# Altium schematic sheet BSPDSchematic.SchDoc
size OrCAD D
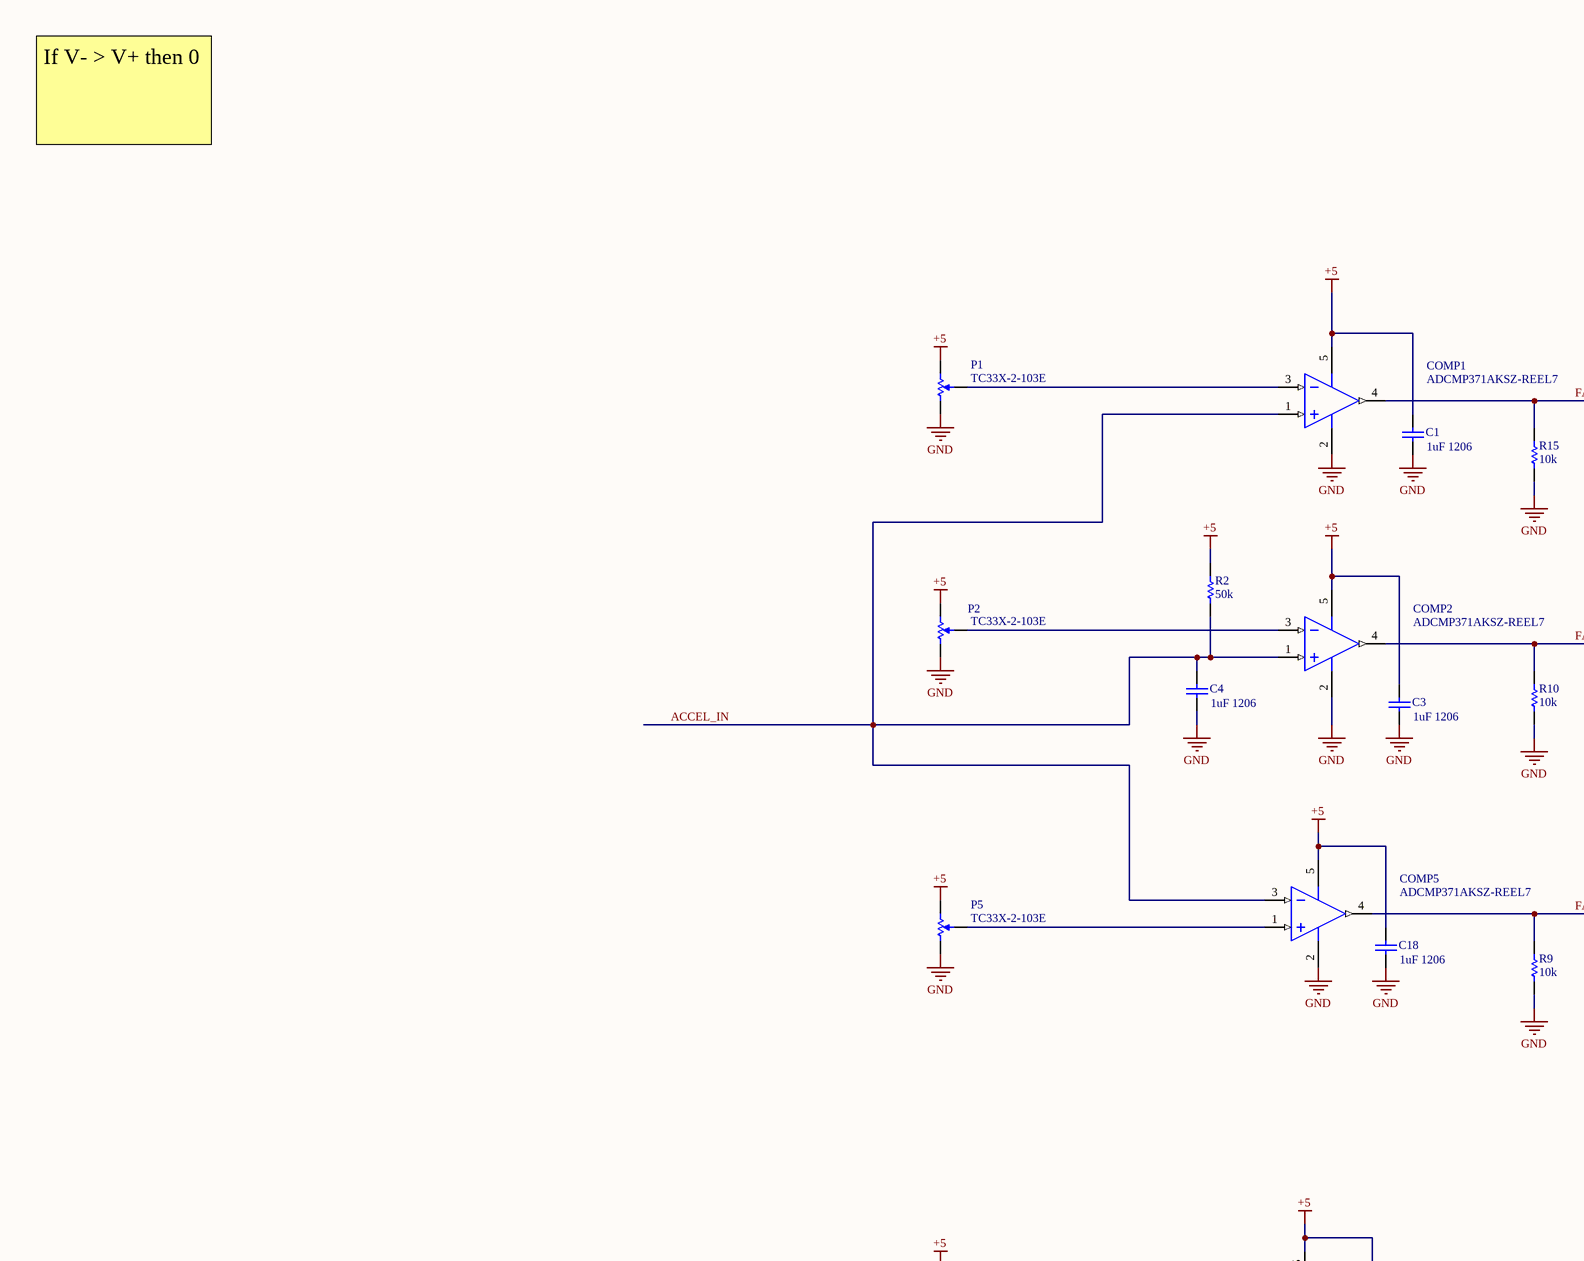
[diagram p0: BSPDSchematic.SchDoc, top left]
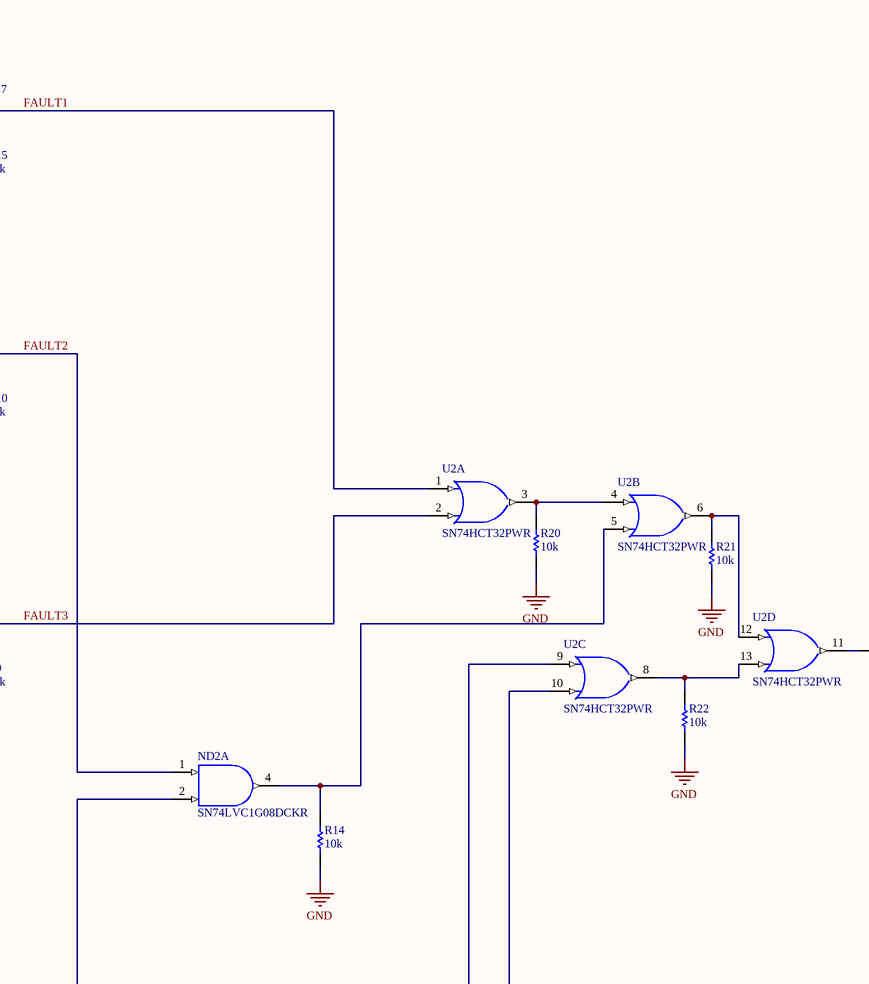
[diagram p1: BSPDSchematic.SchDoc, top middle]
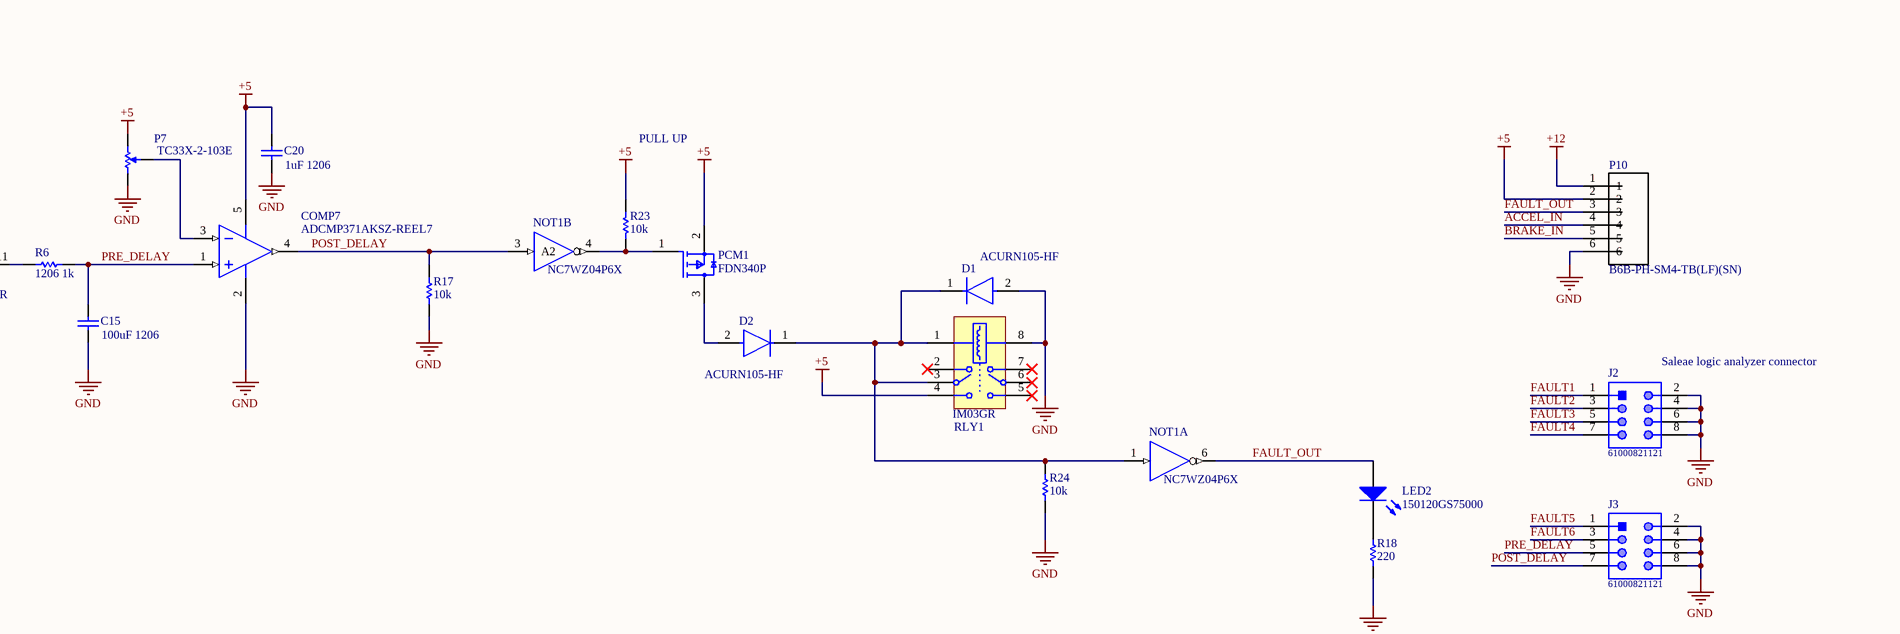
[diagram p2: BSPDSchematic.SchDoc, top right]
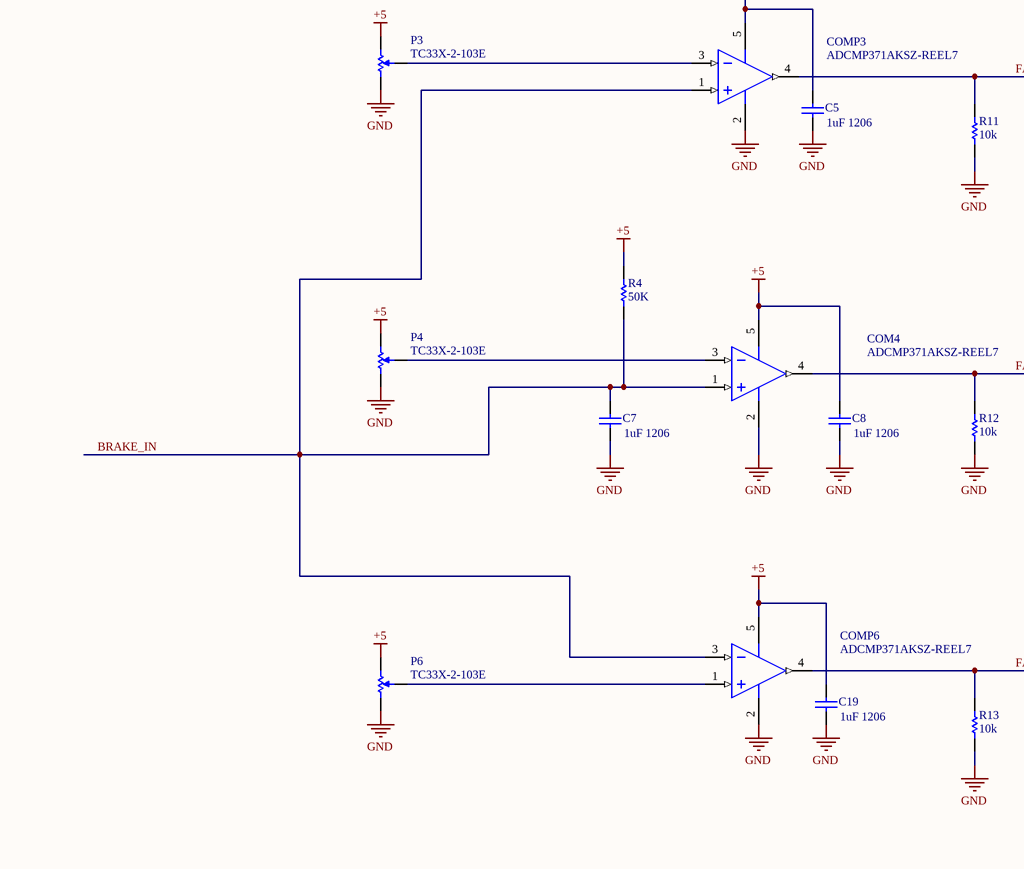
[diagram p3: BSPDSchematic.SchDoc, bottom left]
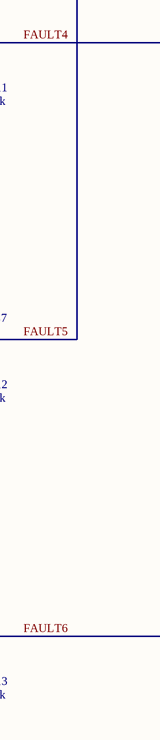
[diagram p4: BSPDSchematic.SchDoc, bottom middle]
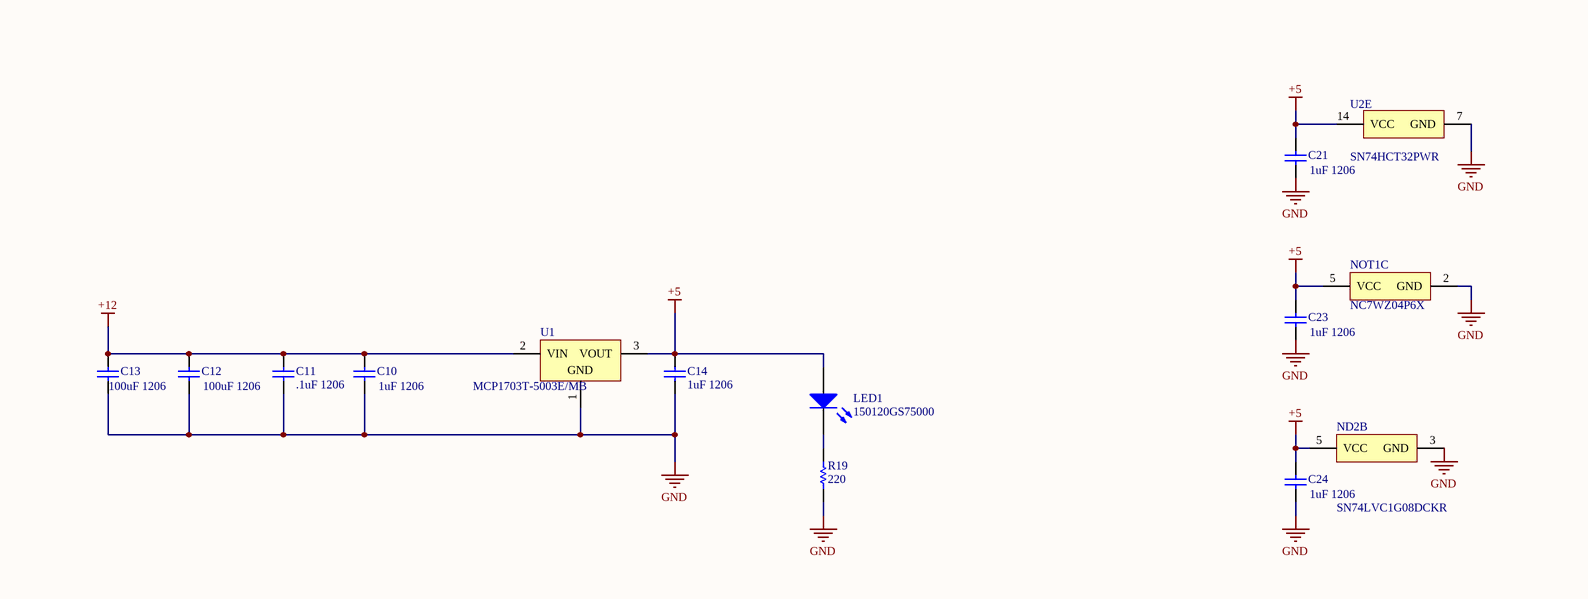
[diagram p5: BSPDSchematic.SchDoc, bottom right]

## Parts
C1  1uF 1206  [CAPC3216X152X50LL20T25]
C3  1uF 1206  [CAPC3216X152X50LL20T25]
C4  1uF 1206  [CAPC3216X152X50LL20T25]
C5  1uF 1206  [CAPC3216X152X50LL20T25]
C7  1uF 1206  [CAPC3216X152X50LL20T25]
C8  1uF 1206  [CAPC3216X152X50LL20T25]
C10  1uF 1206  [CAPC3216X152X50LL20T25]
C11  .1uF 1206  [CAPC1206(3216)190_L]
C12  100uF 1206  [CAPC1206(3216)190_L]
C13  100uF 1206  [CAPC3216X180X50LL20T25]
C14  1uF 1206  [CAPC3216X180X50ML20T25]
C15  100uF 1206  [CAPC3216X152X50LL20T25]
C18  1uF 1206  [CAPC3216X152X50LL20T25]
C19  1uF 1206  [CAPC3216X152X50LL20T25]
C20  1uF 1206  [CAPC3216X152X50LL20T25]
C21  1uF 1206  [CAPC3216X152X50LL20T25]
C23  1uF 1206  [CAPC3216X152X50LL20T25]
C24  1uF 1206  [CAPC3216X152X50LL20T25]
COM4  ADCMP371AKSZ-REEL7  [ADI-KS-5_L]
COMP1  ADCMP371AKSZ-REEL7  [ADI-KS-5_L]
COMP2  ADCMP371AKSZ-REEL7  [ADI-KS-5_L]
COMP3  ADCMP371AKSZ-REEL7  [ADI-KS-5_L]
COMP5  ADCMP371AKSZ-REEL7  [ADI-KS-5_L]
COMP6  ADCMP371AKSZ-REEL7  [ADI-KS-5_L]
COMP7  ADCMP371AKSZ-REEL7  [ADI-KS-5_L]
D1  ACURN105-HF  [FP-1206-MFG]
D2  ACURN105-HF  [FP-1206-MFG]
J2  61000821121  [61000821121]
J3  61000821121  [61000821121]
LED1  150120GS75000  [1206_A]
LED2  150120GS75000  [1206_A]
ND2  SN74LVC1G08DCKR  [DCK0005A_M]  (parts A,B of 2)
NOT1  NC7WZ04P6X  [FAIR-SC70-6_V]  (parts A,B,C of 3)
P1  TC33X-2-103E  [BOUR-TC33X-2_V]
P2  TC33X-2-103E  [BOUR-TC33X-2_V]
P3  TC33X-2-103E  [BOUR-TC33X-2_V]
P4  TC33X-2-103E  [BOUR-TC33X-2_V]
P5  TC33X-2-103E  [BOUR-TC33X-2_V]
P6  TC33X-2-103E  [BOUR-TC33X-2_V]
P7  TC33X-2-103E  [BOUR-TC33X-2_V]
P10  B6B-PH-SM4-TB(LF)(SN)  [*JST_B6B-PH-SM4-TB(LF)(SN)]
PCM1  FDN340P  [FP-527AG-MFG]
R2  50k  [RESC3216X60X45ML10T20]
R4  50K  [RESC3216X60X45ML10T20]
R6  1206 1k  [RESC3216X60X45ML10T20]
R9  10k  [RESC3216X60X45ML10T20]
R10  10k  [RESC3216X60X45ML10T20]
R11  10k  [RESC3216X60X45ML10T20]
R12  10k  [RESC3216X60X45ML10T20]
R13  10k  [RESC3216X60X45ML10T20]
R14  10k  [RESC3216X60X45ML10T20]
R15  10k  [RESC3216X60X45ML10T20]
R17  10k  [RESC3216X60X45ML10T20]
R18  220  [RESC3216X60X45ML10T20]
R19  220  [RESC3216X60X45ML10T20]
R20  10k  [RESC3216X60X45ML10T20]
R21  10k  [RESC3216X60X45ML10T20]
R22  10k  [RESC3216X60X45ML10T20]
R23  10k  [RESC3216X60X45ML10T20]
R24  10k  [RESC3216X60X45ML10T20]
RLY1  IM03GR  [TECO-IM-8G-WING]
U1  MCP1703T-5003E/MB  [SOT-89_L]
U2  SN74HCT32PWR  [PW0014A_N]  (parts A,B,C,D,E of 5)

## Nets
+5: C1.2 C3.2 C5.2 C8.2 C14.2 C18.2 C19.2 C20.2 C21.2 C23.2 C24.2 COM4.5(VCC) COMP1.5(VCC) COMP2.5(VCC) COMP3.5(VCC) COMP5.5(VCC) COMP6.5(VCC) COMP7.5(VCC) LED1.2(A) ND2.5(VCC) NOT1.5(VCC) P1.3 P2.3 P3.3 P4.3 P5.3 P6.3 P7.3 P10.2 PCM1.2(S) R2.1 R4.1 R23.2 RLY1.4 U1.3(VOUT) U2.14(VCC)
+12: C10.2 C11.2 C12.2 C13.2 P10.1 U1.2(VIN)
GND: C1.1 C3.1 C4.1 C5.1 C7.1 C8.1 C10.1 C11.1 C12.1 C13.1 C14.1 C15.1 C18.1 C19.1 C20.1 C21.1 C23.1 C24.1 COM4.2(GND) COMP1.2(GND) COMP2.2(GND) COMP3.2(GND) COMP5.2(GND) COMP6.2(GND) COMP7.2(GND) D1.2(A) J2.2 J2.4 J2.6 J2.8 J3.2 J3.4 J3.6 J3.8 ND2.3(GND) NOT1.2(GND) P1.1 P2.1 P3.1 P4.1 P5.1 P6.1 P7.1 P10.6 R9.2 R10.2 R11.2 R12.2 R13.2 R14.2 R15.2 R17.2 R18.2 R19.2 R20.2 R21.2 R22.2 R24.2 RLY1.8 U1.1(GND) U2.7(GND)
ACCEL_IN: C4.2 COMP1.1(IN+) COMP2.1(IN+) COMP5.3(IN-) P10.4 R2.2
BRAKE_IN: C7.2 COM4.1(IN+) COMP3.1(IN+) COMP6.3(IN-) P10.5 R4.2
FAULT1: COMP1.4(OUT) J2.1 R15.1 U2.1(1A)
FAULT2: COMP2.4(OUT) J2.3 ND2.1(A) R10.1
FAULT3: COMP5.4(OUT) J2.5 R9.1 U2.2(1B)
FAULT4: COMP3.4(OUT) J2.7 R11.1 U2.9(3A)
FAULT5: COM4.4(OUT) J3.1 ND2.2(B) R12.1
FAULT6: COMP6.4(OUT) J3.3 R13.1 U2.10(3B)
FAULT_OUT: LED2.2(A) NOT1.6(Y1) P10.3
POST_DELAY: COMP7.4(OUT) J3.7 NOT1.3(A2) R17.1
PRE_DELAY: C15.2 COMP7.1(IN+) J3.5 R6.2
NetCOM4_3: COM4.3(IN-) P4.2
NetCOMP1_3: COMP1.3(IN-) P1.2
NetCOMP2_3: COMP2.3(IN-) P2.2
NetCOMP3_3: COMP3.3(IN-) P3.2
NetCOMP5_1: COMP5.1(IN+) P5.2
NetCOMP6_1: COMP6.1(IN+) P6.2
NetCOMP7_3: COMP7.3(IN-) P7.2
NetD1_1: D1.1(C) D2.1(C) NOT1.1(A1) R24.1 RLY1.1 RLY1.3
NetD2_2: D2.2(A) PCM1.3(D)
NetLED1_1: LED1.1(K) R19.1
NetLED2_1: LED2.1(K) R18.1
NetND2_4: ND2.4(Y) R14.1 U2.5(2B)
NetNOT1_4: NOT1.4(Y2) PCM1.1(G) R23.1
NetR6_1: R6.1 U2.11(4Y)
NetR20_1: R20.1 U2.3(1Y) U2.4(2A)
NetR21_1: R21.1 U2.6(2Y) U2.12(4A)
NetR22_1: R22.1 U2.8(3Y) U2.13(4B)

Not connected (* = marked no-connect by the designer): RLY1 2* 5* 6* 7*

## Notes on the sheet
- If V- > V+ then 0
- PULL UP
- (near J2) Saleae logic analyzer connector

## Library data of the parts
C1 C3-C5 C7 C8 C10 C15 C18-C21 C23 C24 = CMP-2000-05868-1: Chip Capacitor, 330 nF, +/- 10%, 50 V, -55 to 125 degC, 1206 (3216 Metric), RoHS, Tape and Reel; Manufacturer: AVX; Dielectric: X7R; Capacitance: 330nF; Rated Voltage: 50V; Package Reference: 1206; Tolerance (%): ±10%; Datasheet Version: 07/2016; Manufacturer URL: http://www.avx.com/; Case Size/Dimension: 1206; Datasheet URL: http://datasheets.avx.com/X7RDielectric.pdf; Package Description: 2-Pin Surface Mount Device, Body 3.2 x 1.6 mm; Mounting Technology: SurfaceMount
C11 C12 = CMP-1037-05005-1: CAP 100uF 6.3V ±20% 1206 (3216 Metric) Thickness 1.9mm SMD; Tolerance: Â±20%; Case-EIA: 1206; Case-Metric: 3216; Technology: SMT; Max Thickness: 1.9 mm; Rated Voltage: 6.3 V; Value: 100uF
C13 = CMP-2000-06014-1: Chip Capacitor, 2.2 uF, +/- 10%, 16 V, -55 to 125 degC, 1206 (3216 Metric), RoHS, Tape and Reel; Manufacturer: Kemet; Capacitance - nF: 2200nF; Voltage Rating DC: 16V; Class: Class1; Temperature Coefficient / Code: +/-15%; Case Height: 1mm; Dissipation Factor DF: 5; Capacitance: 2.2uF; Type: SMDMLCCX7R6.3-250VDCCommericalGrade; Case Width: 1.6mm; Dielectric: X7R; Case Length: 3.2mm; Series: C1206C; Tolerance: 10%; Datasheet URL: http://www.kemet.com/docfinder?Partnumber=C1206C106K8RACTU; Package Description: 2-Pin Surface Mount Device, Body 3.2 x 1.6 mm; RoHS: Details; Datasheet Version: 02/2016; Package / Case: 1206(3216metric); Case Code - mm: 3216; Packaging: Reel; Product Category: MultilayerCeramicCapacitorsMLCC-SMD/SMT; Package Reference: 1206; Maximum Operating Temperature: +125C; Mounting Technology: SurfaceMount; Dimensions: 1.6mmWx3.2mmLx1mmH; Case Code - in: 1206; Minimum Operating Temperature: -55C; Operating Temperature Range: -55Cto+125C; Brand: Kemet; Product: GeneralTypeMLCCs; Factory Pack Quantity: 2000; Voltage Rating: 16V; Termination Style: SMD/SMT; Manufacturer URL: http://www.kemet.com/
C14 = CMP-2000-04991-1: Chip Capacitor, 1 uF, +/- 10%, 25 V, -55 to 125 degC, 1206 (3216 Metric), RoHS, Tape and Reel; Manufacturer: Kemet; Temperature Coefficient / Code: +/-15%; Dielectric: X7R; Voltage Rating DC: 25V; Capacitance - nF: 1000nF; Class: Class1; Case Length: 3.2mm; Type: SMDMLCCX7R6.3-250VDCCommericalGrade; Case Width: 1.6mm; Product: GeneralTypeMLCCs; Capacitance: 1uF; Datasheet URL: https://ciiva.com/datasheet-click-18194173?src=ciiva&sig=6daff8c4; Operating Temperature Range: -55Cto+125C; Series: C1206C; RoHS: Details; Product Category: MultilayerCeramicCapacitorsMLCC-SMD/SMT; Manufacturer URL: http://www.kemet.com/; Minimum Operating Temperature: -55C; Dimensions: 1.6mmWx3.2mmLx1.6mmH; Termination Style: SMD/SMT; Brand: Kemet; Packaging: Reel; Package / Case: 1206(3216metric); Case Code - mm: 3216; Datasheet Version: Jul-14; Factory Pack Quantity: 2000; Package Description: 2-Pin Surface Mount Device, Body 3.2 x 1.6 mm; Tolerance: 10%; Package Reference: 1206; Case Height: 1.6mm; Case Code - in: 1206; Maximum Operating Temperature: +125C; Voltage Rating: 25V
COM4 COMP1-COMP3 COMP5-COMP7 = CMP-0783-00038-1: General-Purpose Comparator, 2.25 to 5.5 V, 5 us Delay, Industrial, 5-pin SOT23 (KS-5), Reel; Manufacturer: Analog Devices; Input Range (V): 0 to VCC; Supply Current: 4uA; PackageDescription: 5-Pin Thin Shrink Small Outline Transistor Package, Body 2 x 1.25 mm, Pitch 0.65 mm; Voltage Supply (V): 2.25 to 5.5; ComponentLink1URL: http://www.analog.com/en/index.html; ComponentLink2Description: Datasheet; ComponentLink5URL: Reference Circuit:http://www.analog.com/en/special-linear-functions/comparators/adcmp371/products/product.html#product-recommendations; ComponentLink4Description: URL Link1; PackageVersion: 072809-A, 07/2009; PackageReference: KS-5; Mounting Technology: Surface Mount; ComponentLink3Description: Package Specification; ComponentLink4URL: Product URL:http://www.analog.com/en/special-linear-functions/comparators/adcmp371/products/product.html; ComponentLink5Description: URL Link2; DatasheetVersion: Rev. B; Code_JEDEC: MO-203-AA; ComponentLink1Description: Manufacturer URL; PartNumber: ADCMP371AKSZ-REEL7; Packing: Reel; ComponentLink3URL: http://www.analog.com/static/imported-files/packages/PKG_PDF/SC70(KS)/KS_5.pdf; ComponentLink2URL: http://www.analog.com/static/imported-files/data_sheets/ADCMP370_371.pdf
D1 D2 = CMP-20228-000003-1: DIODE GEN PURP 1KV 1A 1206; Reverse Recovery Time: 75ns; Max Surge Current: 30A; Peak Reverse Current: 80nA; Forward Voltage: 1.45V; Max Reverse Voltage (DC): 1kV; Package Quantity: 3000; Mount: Surface Mount; Case Code (Imperial): 1206; Case/Package: SMD/SMT; Max Operating Temperature: 175°C; Case Code (Metric): 3216; Average Rectified Current: 1A; Packaging: Tape and Reel; Recovery Time: 75ns; Reverse Voltage (DC): 1kV; Forward Current: 1A; Min Operating Temperature: -65°C
J2 J3 = CMP-1502-01025-1: SMT Vertical Pin Header WR-PHD, Pitch 2.54 mm, Dual Row, 8 pins; Manufacturer: Wurth Elektronik; Gender: Male; Rated Current: 3A; Contact Resistance: 20mOhm; Working Voltage: 250VAC; Pitch: 2.54mm; Pin Number: 8; Withstanding Voltage: 500VAC; Row Number: Dual; Mounting Technology: SMT; Orientation: Vertical; Part Number: 61000821121; Operating Temperature: -40to125degC; Package Reference: 61000821121; Datasheet URL: https://katalog.we-online.de/em/datasheet/6100xx21121.pdf; Packaging: Tube; Publisher: WurthElektronik; Manufacturer URL: http://www.we-online.de
LED1 LED2 = CMP-1426-00014-1: SMD mono-color Chip LED, WL-SMCW, Green; Manufacturer: Wuerth Elektronik; PackageReference: 1206_A; PartNumber: 150120GS75000; ComponentLink1Description: Manufacturer URL; ComponentLink2URL: http://katalog.we-online.com/led/datasheet/150120GS75000.pdf; ComponentLink2Description: Datasheet; Color: Green; ComponentLink1URL: http://www.we-online.com
ND2 = CMP-0859-00266-3: Single 2-Input Positive-AND Gate, DCK0005A, LARGE T&R; Manufacturer: Texas Instruments; tpd @ Nom Voltage(Max)(ns): 4.5,6,4,5; F @ Nom Voltage(Max)(Mhz): 150; ICC @ Nom Voltage(Max)(mA): 0.01; Bits(#): 1; VCC(Min)(V): 1.65; Gate Type: AND; Rating: Catalog; Output Type: CMOS; Voltage(Nom)(V): 1.8,2.5,3.3,5; Technology Family: LVC; VCC(Max)(V): 5.5; Input Type: CMOS/TTL; Schmitt Trigger: No; Output Drive (IOL/IOH)(Max)(mA): 32/-32; Logic: True; Generic Part Number: SN74LVC1G08; DatasheetVersion: SCES217Y; Sub-Family: AND Gate; 3-State Output: No; Operating Temperature Range(C): -40 to 125,-40 to 85; PackageReference: DCK0005A
NOT1 = CMP-2000-06821-1: TinyLogic UHS Dual Inverter, 1.65 to 5.5 V, -40 to 85 degC, 6-Pin SOT23 (SC70), RoHS, Tape and Reel; Manufacturer: Fairchild Semiconductor; Product Change Notification: MoldCompoundChange12/Dec/2007; Dynamic Catalog: 7WZ; Current - Output High, Low: 32mA,32mA; Current - Quiescent (Max): 1µA; Voltage - Supply: 1.65V~5.5V; Max Propagation Delay @ V, Max CL: 3.6ns@5V,50pF; Other Names: NC7WZ04P6XDKR; Logic Type: Inverter,Buffer; Number of Inputs: 1; Number of Circuits: 2; Mounting Type: SurfaceMount; Series: 7WZ; Supplier Device Package: SC-70-6; Family: Logic-GatesandInverters; Package Description: 6-Pin Small Outline Transistor, Body 2 x 1.25 mm, Pitch 0.65 mm; Category: IntegratedCircuits(ICs); Package / Case: 6-TSSOP,SC-88,SOT-363; Datasheet Version: Rev. 1.0.2, 12/2009; Logic Level - High: -; Datasheet URL: https://www.fairchildsemi.com/datasheets/NC/NC7WZ04.pdf; Operating Temperature: -40°C~85°C; Mounting Technology: SurfaceMount; Package URL: https://www.fairchildsemi.com/package-drawings/MA/MAA06A.pdf; Logic Level - Low: -; Package Reference: SC70-6; Manufacturer URL: https://www.fairchildsemi.com/; Standard Package: 1; Packaging: Digi-Reel®; Features: -
P1-P7 = CMP-2100-03695-1: Trimming Potentiometer, 10000 Ohm, -40 to 100 degC, 3-Pin SMD, RoHS, Tape and Reel; Manufacturer: Bourns; Tolerance: 25%; Max Power Dissipation: 100mW; Number of Turns: 1; Resistance: 10KOhm; Temperature Coefficient: 250ppm/degreesC; Voltage Rating (DC): 50V; Datasheet URL: http://www.bourns.com/docs/Product-Datasheets/TC33.pdf; Composition: Potentiometer; Package Description: 3-Pin Surface Mount Device, Body 3.8 x 3.6 mm; Weight: 29.4mg; Power Rating: 100mW; Termination: FootPrint; Manufacturer URL: http://www.bourns.com/; Width: 0.118inch; Height: 0.047inch; Military Standard: Not; Radiation Hardening: No; Colour: Silver; Case/Package: SMD/SMT; Depth: 3.8mm; Min Operating Temperature: -40degC; Lead Free: LeadFree; Datasheet Version: 42583.0; REACH SVHC: NoSVHC; Length: 3mm; RoHSCompliant: true; Contact Plating: Silver; Taper: Linear; Packaging: TapeandReel; Mount: SurfaceMount; Max Operating Temperature: 100degC; Package Reference: TC33X-2; Package Quantity: 2500
P10 = B6B-PH-SM4-TB(LF)(SN): Connector Header Surface Mount 6 position 0.079 _2.00mm_; MP: B6B-PH-SM4-TB_LF__SN_; MF: JST Sales; SnapEDA_Link: https://www.snapeda.com/parts/B6B-PH-SM4-TB%28LF%29%28SN%29/JST%20Sales%20America%20Inc./view-part/52131/?ref=snap; Availability: Unavailable; Price: None; Package: None; Value: *
PCM1 = CMP-2100-03638-2: MOSFET P-CH 20V 2A SSOT3; Fall Time: 11ns; Rise Time: 9ns; Voltage Rating (DC): -20V; Power Dissipation: 500mW; Nominal Vgs: -800mV; Current Rating: -2A; Gate to Source Voltage (Vgs): 8V; Rds On Max: 70mR; Turn-Off Delay Time: 27ns; Element Configuration: Single; Number of Elements: 1; Input Capacitance: 779pF; Drain to Source Resistance: 60mR; Turn-On Delay Time: 10ns; Package Quantity: 1; Mount: Surface Mount; Case/Package: SOT-23; Min Operating Temperature: -55°C; REACH SVHC: No SVHC; Weight: 0.03g; Packaging: Tape and Reel; Threshold Voltage: -800mV; Max Operating Temperature: 150°C; Dual Supply Voltage: -20V; Termination: SMD/SMT; Drain to Source Voltage (Vdss): 20V; Height: 0.94mm; Length: 2.92mm; Contact Plating: Tin; Width: 3.05mm; Drain to Source Breakdown Voltage: -20V; Max Power Dissipation: 500mW; Continuous Drain Current (ID): 2A; Number of Pins: 3; Lead Free: Lead Free; Radiation Hardening: No; On-State Resistance: 70MR
R2 R4 R6 R9-R15 R17-R24 = CMP-2003-01956-1: Manufacturer: Vishay Dale; Part Number: CRCW1206220RFKEA
RLY1 = CMP-0439-00001-1: Low Power Consumption, High Dielectric, High Mechanical Shock Resistance, IM Relay; Manufacturer: TE Connectivity; Power Consumption: 140 mW; Contact Capacitance: 1 pF; Coil-contact Capacitance: 2 pF; Limiting Continuous Current: 2 A; ComponentLink1Description: Manufacturer URL; PackageReference: IM-8G-WING; Contact Material: PdRu +Au Covered; DatasheetVersion: Rev. 0411; ComponentLink2URL: http://www.te.com/commerce/DocumentDelivery/DDEController?Action=showdoc&DocId=Specification+Or+Standard%7F108-98001%7FS%7Fpdf%7FEnglish%7FENG_SS_108-98001_S.pdf%7F1-1462037-4; ComponentLink2Description: Datasheet; Mounting Technology: Surface Mount; Ambient Temperature: -40 to 85 degC; PartNumber: IM03GR; ComponentLink1URL: http://www.te.com/; PackageDescription: 8-Pin Relay, 10 x 6 mm Body, 0.95 mm Pitch
U1 = CMP-0244-00395-1: IC REG LINEAR 5V 100MA SOT89-3; ComponentLink1Description: Manufacturer URL; ComponentLink2Description: Datasheet; PackageVersion: 2011; ComponentLink2URL: http://www.st.com/internet/com/TECHNICAL_RESOURCES/TECHNICAL_LITERATURE/DATASHEET/CD00000539.pdf; PackageReference: SOT-89; DatasheetVersion: 1/07/2009; PackageDescription: 3-Pin SOT-89 Package 1.5 mm Pitch, 4.1 mm Lead Span; ComponentLink1URL: http://www.st.com
U2 = CMP-1573-00187-3: Quadruple 2-Input Positive-OR Gates, PW0014A, LARGE T&R; Manufacturer: Texas Instruments; Output Type: CMOS; F @ Nom Voltage(Max)(Mhz): 25; Bits(#): 4; ICC @ Nom Voltage(Max)(mA): 0.02; Rating: Catalog; VCC(Min)(V): 4.5; tpd @ Nom Voltage(Max)(ns): 27; Input Type: TTL; Output Drive (IOL/IOH)(Max)(mA): 4/-4; Voltage(Nom)(V): 5; VCC(Max)(V): 5.5; DatasheetVersion: SCLS064E; Operating Temperature Range(C): -40 to 85; PackageReference: PW0014A; Code_JEDEC: MO-153; PackageVersion: http://www.ti.com/lit/ml/mpds360/mpds360.pdf; Generic Part Number: SN74HCT32